# Altium schematic sheet CAN.SchDoc
size A4; SheetNumber: 2; SheetTotal: 6
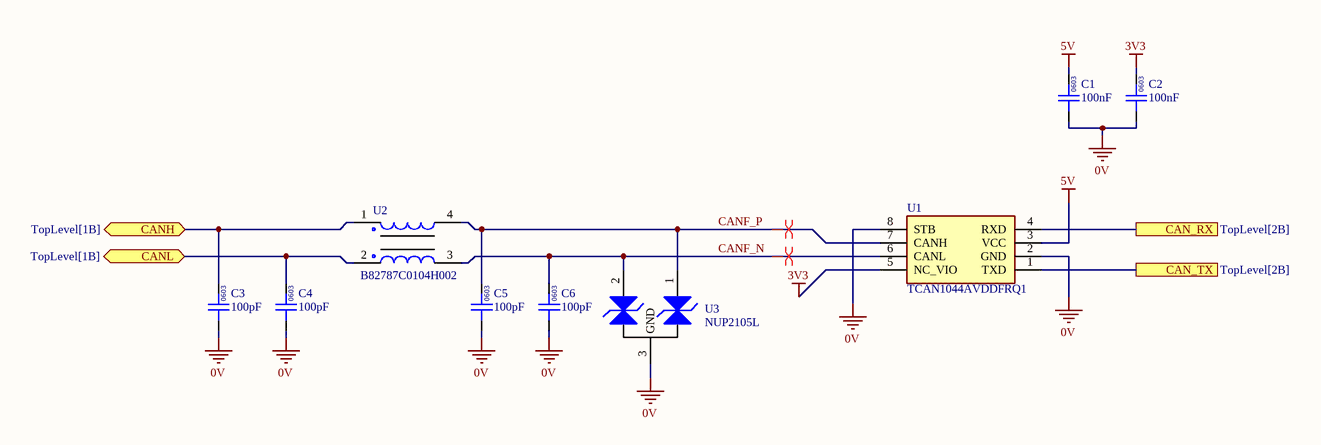
[diagram p0: CAN.SchDoc]

## Parts
C1  100nF  [0603]
C2  100nF  [0603]
C3  100pF  [0603]
C4  100pF  [0603]
C5  100pF  [0603]
C6  100pF  [0603]
U1  TCAN1044AVDDFRQ1  [SOT65P280X110-8N]
U2  B82787C0104H002  [TDK 4-PC Pad]
U3  NUP2105L  [ON SOT-23]

## Ports
CAN_RX (see TopLevel[2B]), CAN_TX (see TopLevel[2B]), CANH (bidir, see TopLevel[1B]), CANL (bidir, see TopLevel[1B])

## Nets
0V: C1.1 C2.1 C3.1 C4.1 C5.1 C6.1 U1.2(GND) U1.8(STB) U3.3(GND)
3V3: C2.2 U1.5(NC_VIO)
5V: C1.2 U1.3(VCC)
CAN_RX: U1.4(RXD) ; port CAN_RX
CAN_TX: U1.1(TXD) ; port CAN_TX
CANF_N: C6.2 U1.6(CANL) U2.3 U3.2(CAN_L)
CANF_P: C5.2 U1.7(CANH) U2.4 U3.1(CAN_H)
CANH: C3.2 U2.1 ; port CANH
CANL: C4.2 U2.2 ; port CANL

## Layout directives
differential pair: CANF_N, CANF_P

## Notes on the sheet
- (in symbol GCM188L81H104KA57D) 0603
- (in symbol GRM1885C1H101JA01D) 0603

## Library data of the parts
C1 C2 = GCM188L81H104KA57D: Manufacturer: muRata; Rated Voltage: 50V; Tolerance: ±10%; Material: MLCC; Temperature Rating: X8L; Part Number: GCM188L81H104KA57D; Value: 100nF; Digikey Part Number: 490-6049-1-ND
C3-C6 = GRM1885C1H101JA01D: Manufacturer: Murata Electronics; Rated Voltage: 50V; Tolerance: ±5%; Material: MLCC; Temperature Rating: C0G, NP0; Part Number: GRM1885C1H101JA01D; Value: 100pF; Digikey Part Number: 490-1427-1-ND
U1 = TCAN1044AVDDFRQ1: Integrated Circuit; Manufacturer_Name: Texas Instruments; Datasheet Link: https://www.ti.com/lit/gpn/tcan1044av-q1; Height: 1.1mm; Manufacturer_Part_Number: TCAN1044AVDDFRQ1; Mouser Part Number: 595-TCAN1044AVDDFRQ1; Mouser Price/Stock: https://www.mouser.co.uk/ProductDetail/Texas-Instruments/TCAN1044AVDDFRQ1?qs=7D1LtPJG0i2h5Rps6Zy%2FQg%3D%3D; Arrow Part Number: TCAN1044AVDDFRQ1; Arrow Price/Stock: https://www.arrow.com/en/products/tcan1044avddfrq1/texas-instruments?region=nac
U2 = B82787C0104H002: Manufacturer: EPCOS (TDK); Value: 100µH @ 100kHz; Impedance: 5.8 kOhms @ 10MHz; Rated Current: 150mA; Part Number: B82787C0104H002; Material: Wirewound; Digikey Part Number: 495-4598-1-ND
U3 = NUP2105L: Dual Line CAN Bus Protector; Manufacturer: ON Semiconductor; Part Number: NUP2105L; Digikey Part Number: NUP2105LT1GOSCT-ND; Digikey Link: https://www.digikey.com/product-detail/en/on-semiconductor/NUP2105LT1G/NUP2105LT1GOSCT-ND/1485001